# EAGLE schematic euxoloti core rev2 (EAGLE 6.1)

## Sheet 1 of 3
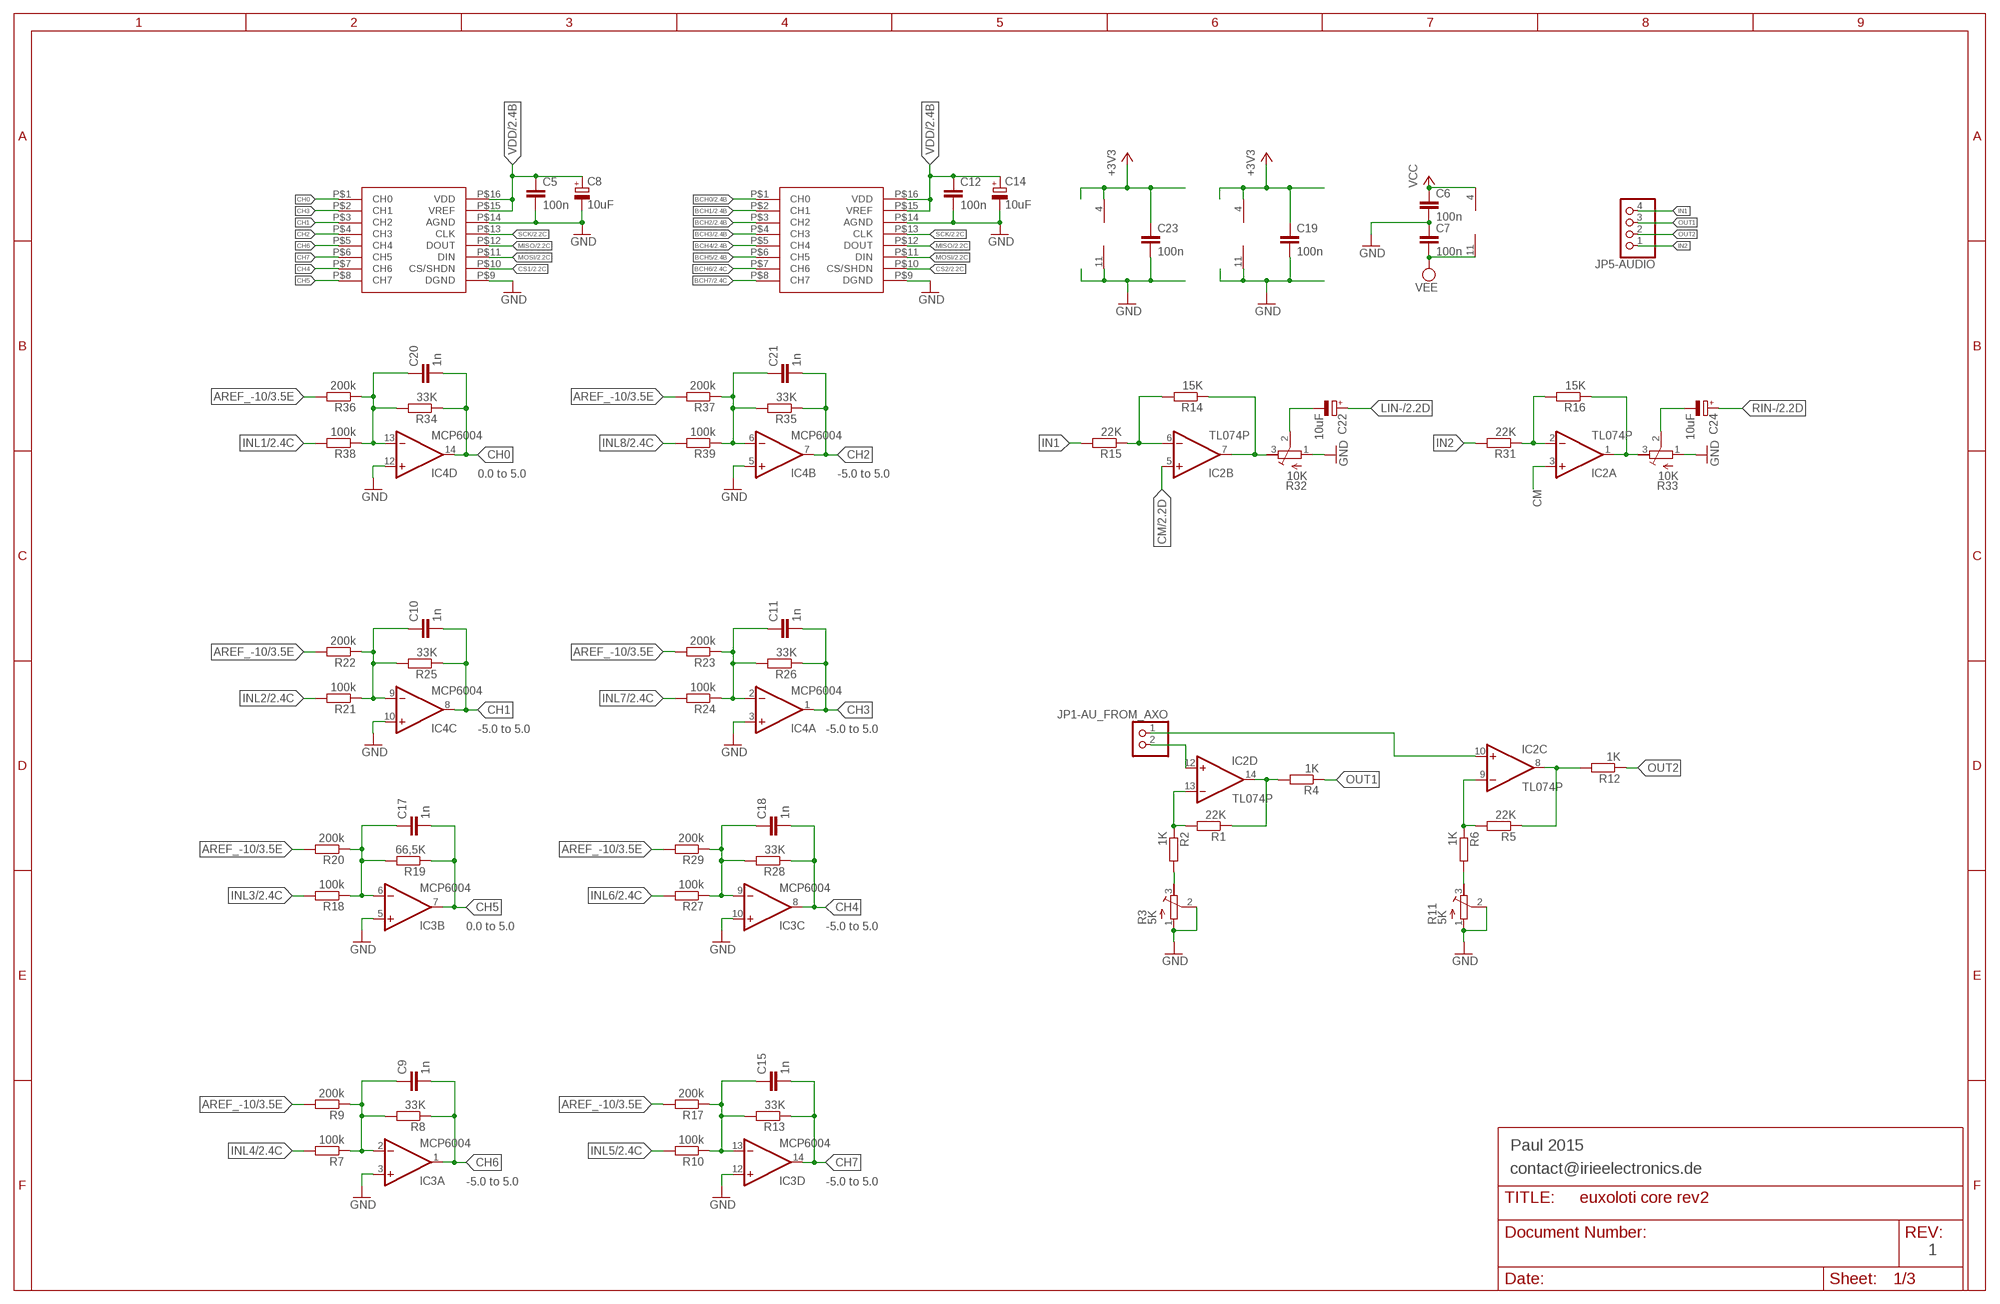
[diagram p0: schematic, sheet 1]

### Parts
C5  100n  C-EU025-025X050  [C025-025X050]
C6  100n  C-EU025-025X050  [C025-025X050]
C7  100n  C-EU025-025X050  [C025-025X050]
C8  10uF  CPOL-EUE1.8-4  [E1,8-4]
C9  1n  C-EU050-025X075  [C050-025X075]
C10  1n  C-EU050-025X075  [C050-025X075]
C11  1n  C-EU050-025X075  [C050-025X075]
C12  100n  C-EU025-025X050  [C025-025X050]
C14  10uF  CPOL-EUE1.8-4  [E1,8-4]
C15  1n  C-EU050-025X075  [C050-025X075]
C17  1n  C-EU050-025X075  [C050-025X075]
C18  1n  C-EU050-025X075  [C050-025X075]
C19  100n  C-EU025-025X050  [C025-025X050]
C20  1n  C-EU050-025X075  [C050-025X075]
C21  1n  C-EU050-025X075  [C050-025X075]
C22  10uF  CPOL-EUE1.8-4  [E1,8-4]
C23  100n  C-EU025-025X050  [C025-025X050]
C24  10uF  CPOL-EUE1.8-4  [E1,8-4]
IC2  TL074P  [DIL14]
IC3  MCP6004  TL074P  [DIL14]
IC4  MCP6004  TL074P  [DIL14]
JP1-AU_FROM_AXO  PINHD-1X2/90  [1X02/90]
JP5-AUDIO  PINHD-1X4_2.54  [1X04]
R1  22K  R-EU_0207/10  [0207/10]
R2  1K  R-EU_0207/12  [0207/12]
R3  5K  R-TRIMM3296P  [RTRIM3296P]
R4  1K  R-EU_0207/7  [0207/7]
R5  22K  R-EU_0207/7  [0207/7]
R6  1K  R-EU_0207/7  [0207/7]
R7  100k  R-EU_0207/7  [0207/7]
R8  33K  R-EU_0207/7  [0207/7]
R9  200k  R-EU_0207/10  [0207/10]
R10  100k  R-EU_0207/7  [0207/7]
R11  5K  R-TRIMM3296P  [RTRIM3296P]
R12  1K  R-EU_0207/10  [0207/10]
R13  33K  R-EU_0207/7  [0207/7]
R14  15K  R-EU_0207/7  [0207/7]
R15  22K  R-EU_0207/7  [0207/7]
R16  15K  R-EU_0207/7  [0207/7]
R17  200k  R-EU_0207/7  [0207/7]
R18  100k  R-EU_0207/7  [0207/7]
R19  66,5K  R-EU_0207/7  [0207/7]
R20  200k  R-EU_0207/10  [0207/10]
R21  100k  R-EU_0207/7  [0207/7]
R22  200k  R-EU_0207/7  [0207/7]
R23  200k  R-EU_0207/7  [0207/7]
R24  100k  R-EU_0207/10  [0207/10]
R25  33K  R-EU_0207/7  [0207/7]
R26  33K  R-EU_0207/7  [0207/7]
R27  100k  R-EU_0207/7  [0207/7]
R28  33K  R-EU_0207/7  [0207/7]
R29  200k  R-EU_0207/7  [0207/7]
R31  22K  R-EU_0207/7  [0207/7]
R32  10K  R-TRIMM3296P  [RTRIM3296P]
R33  10K  R-TRIMM3296P  [RTRIM3296P]
R34  33K  R-EU_0207/7  [0207/7]
R35  33K  R-EU_0207/7  [0207/7]
R36  200k  R-EU_0207/7  [0207/7]
R37  200k  R-EU_0207/7  [0207/7]
R38  100k  R-EU_0207/7  [0207/7]
R39  100k  R-EU_0207/7  [0207/7]
U$4  MCP3208_DIP  [MCP2308]
U$5  MCP3208_DIP  [MCP2308]

### Nets
+3V3: C19.1 C23.1 IC3.4(P:V+) IC4.4(P:V+) ; also sheet 2
AREF_-10: R9.2 R17.2 R20.2 R22.2 R23.2 R29.2 R36.2 R37.2 ; also sheet 3
BCH0: U$5.P$1(CH0) ; also sheet 2
BCH1: U$5.P$2(CH1) ; also sheet 2
BCH2: U$5.P$3(CH2) ; also sheet 2
BCH3: U$5.P$4(CH3) ; also sheet 2
BCH4: U$5.P$5(CH4) ; also sheet 2
BCH5: U$5.P$6(CH5) ; also sheet 2
BCH6: U$5.P$7(CH6) ; also sheet 2
BCH7: U$5.P$8(CH7) ; also sheet 2
CH0: C20.2 IC4.14(D:OUT) R34.1 U$4.P$1(CH0)
CH1: C10.2 IC4.8(C:OUT) R25.1 U$4.P$3(CH2)
CH2: C21.2 IC4.7(B:OUT) R35.1 U$4.P$4(CH3)
CH3: C11.2 IC4.1(A:OUT) R26.1 U$4.P$2(CH1)
CH4: C18.2 IC3.8(C:OUT) R28.1 U$4.P$7(CH6)
CH5: C17.2 IC3.7(B:OUT) R19.1 U$4.P$8(CH7)
CH6: C9.2 IC3.1(A:OUT) R8.1 U$4.P$5(CH4)
CH7: C15.2 IC3.14(D:OUT) R13.1 U$4.P$6(CH5)
CM: IC2.3(A:+IN) IC2.5(B:+IN) ; also sheet 2
CS1: U$4.P$10(CS/SHDN) ; also sheet 2
CS2: U$5.P$10(CS/SHDN) ; also sheet 2
GND: C5.2 C6.2 C7.1 C8.- C12.2 C14.- C19.2 C23.2 IC3.3(A:+IN) IC3.5(B:+IN) IC3.10(C:+IN) IC3.11(P:V-) IC3.12(D:+IN) IC4.3(A:+IN) IC4.5(B:+IN) IC4.10(C:+IN) IC4.11(P:V-) IC4.12(D:+IN) R3.1(E) R3.2(S) R11.1(E) R11.2(S) R32.1(E) R33.1(E) U$4.P$9(DGND) U$4.P$14(AGND) U$5.P$9(DGND) U$5.P$14(AGND) ; also sheet 2,3
IN1: JP5-AUDIO.4 R15.2
IN2: JP5-AUDIO.1 R31.2
INL1: R38.2 ; also sheet 2
INL2: R21.2 ; also sheet 2
INL3: R18.2 ; also sheet 2
INL4: R7.2 ; also sheet 2
INL5: R10.2 ; also sheet 2
INL6: R27.2 ; also sheet 2
INL7: R24.2 ; also sheet 2
INL8: R39.2 ; also sheet 2
LIN-: C22.+ ; also sheet 2
MISO: U$4.P$12(DOUT) U$5.P$12(DOUT) ; also sheet 2
MOSI: U$4.P$11(DIN) U$5.P$11(DIN) ; also sheet 2
N$2: C10.1 IC4.9(C:-IN) R21.1 R22.1 R25.2
N$4: R2.2 R3.3(A)
N$5: C11.1 IC4.2(A:-IN) R23.1 R24.1 R26.2
N$6: IC2.13(D:-IN) R1.2 R2.1
N$7: IC2.14(D:OUT) R1.1 R4.2
N$8: C22.- R32.2(S)
N$9: R6.2 R11.3(A)
N$10: IC2.9(C:-IN) R5.2 R6.1
N$11: C20.1 IC4.13(D:-IN) R34.2 R36.1 R38.1
N$12: IC2.8(C:OUT) R5.1 R12.2
N$13: IC2.10(C:+IN) JP1-AU_FROM_AXO.1
N$14: IC2.12(D:+IN) JP1-AU_FROM_AXO.2
N$15: C21.1 IC4.6(B:-IN) R35.2 R37.1 R39.1
N$16: C24.- R33.2(S)
N$17: IC2.6(B:-IN) R14.2 R15.1
N$18: C9.1 IC3.2(A:-IN) R7.1 R8.2 R9.1
N$19: IC2.7(B:OUT) R14.1 R32.3(A)
N$20: C15.1 IC3.13(D:-IN) R10.1 R13.2 R17.1
N$21: IC2.2(A:-IN) R16.2 R31.1
N$22: C17.1 IC3.6(B:-IN) R18.1 R19.2 R20.1
N$23: IC2.1(A:OUT) R16.1 R33.3(A)
N$24: C18.1 IC3.9(C:-IN) R27.1 R28.2 R29.1
OUT1: JP5-AUDIO.3 R4.1
OUT2: JP5-AUDIO.2 R12.1
RIN-: C24.+ ; also sheet 2
SCK: U$4.P$13(CLK) U$5.P$13(CLK) ; also sheet 2
VCC: C6.1 IC2.4(P:V+) ; also sheet 3
VDD: C5.1 C8.+ C12.1 C14.+ U$4.P$15(VREF) U$4.P$16(VDD) U$5.P$15(VREF) U$5.P$16(VDD) ; also sheet 2
VEE: C7.2 IC2.11(P:V-) ; also sheet 3

### Notes on the sheet
- 0.0 to 5.0 | -5.0 to 5.0
- -5.0 to 5.0 | -5.0 to 5.0
- 0.0 to 5.0 | -5.0 to 5.0
- Paul 2015
- contact@irieelectronics.de
- -5.0 to 5.0 | -5.0 to 5.0
- 1

## Sheet 2 of 3
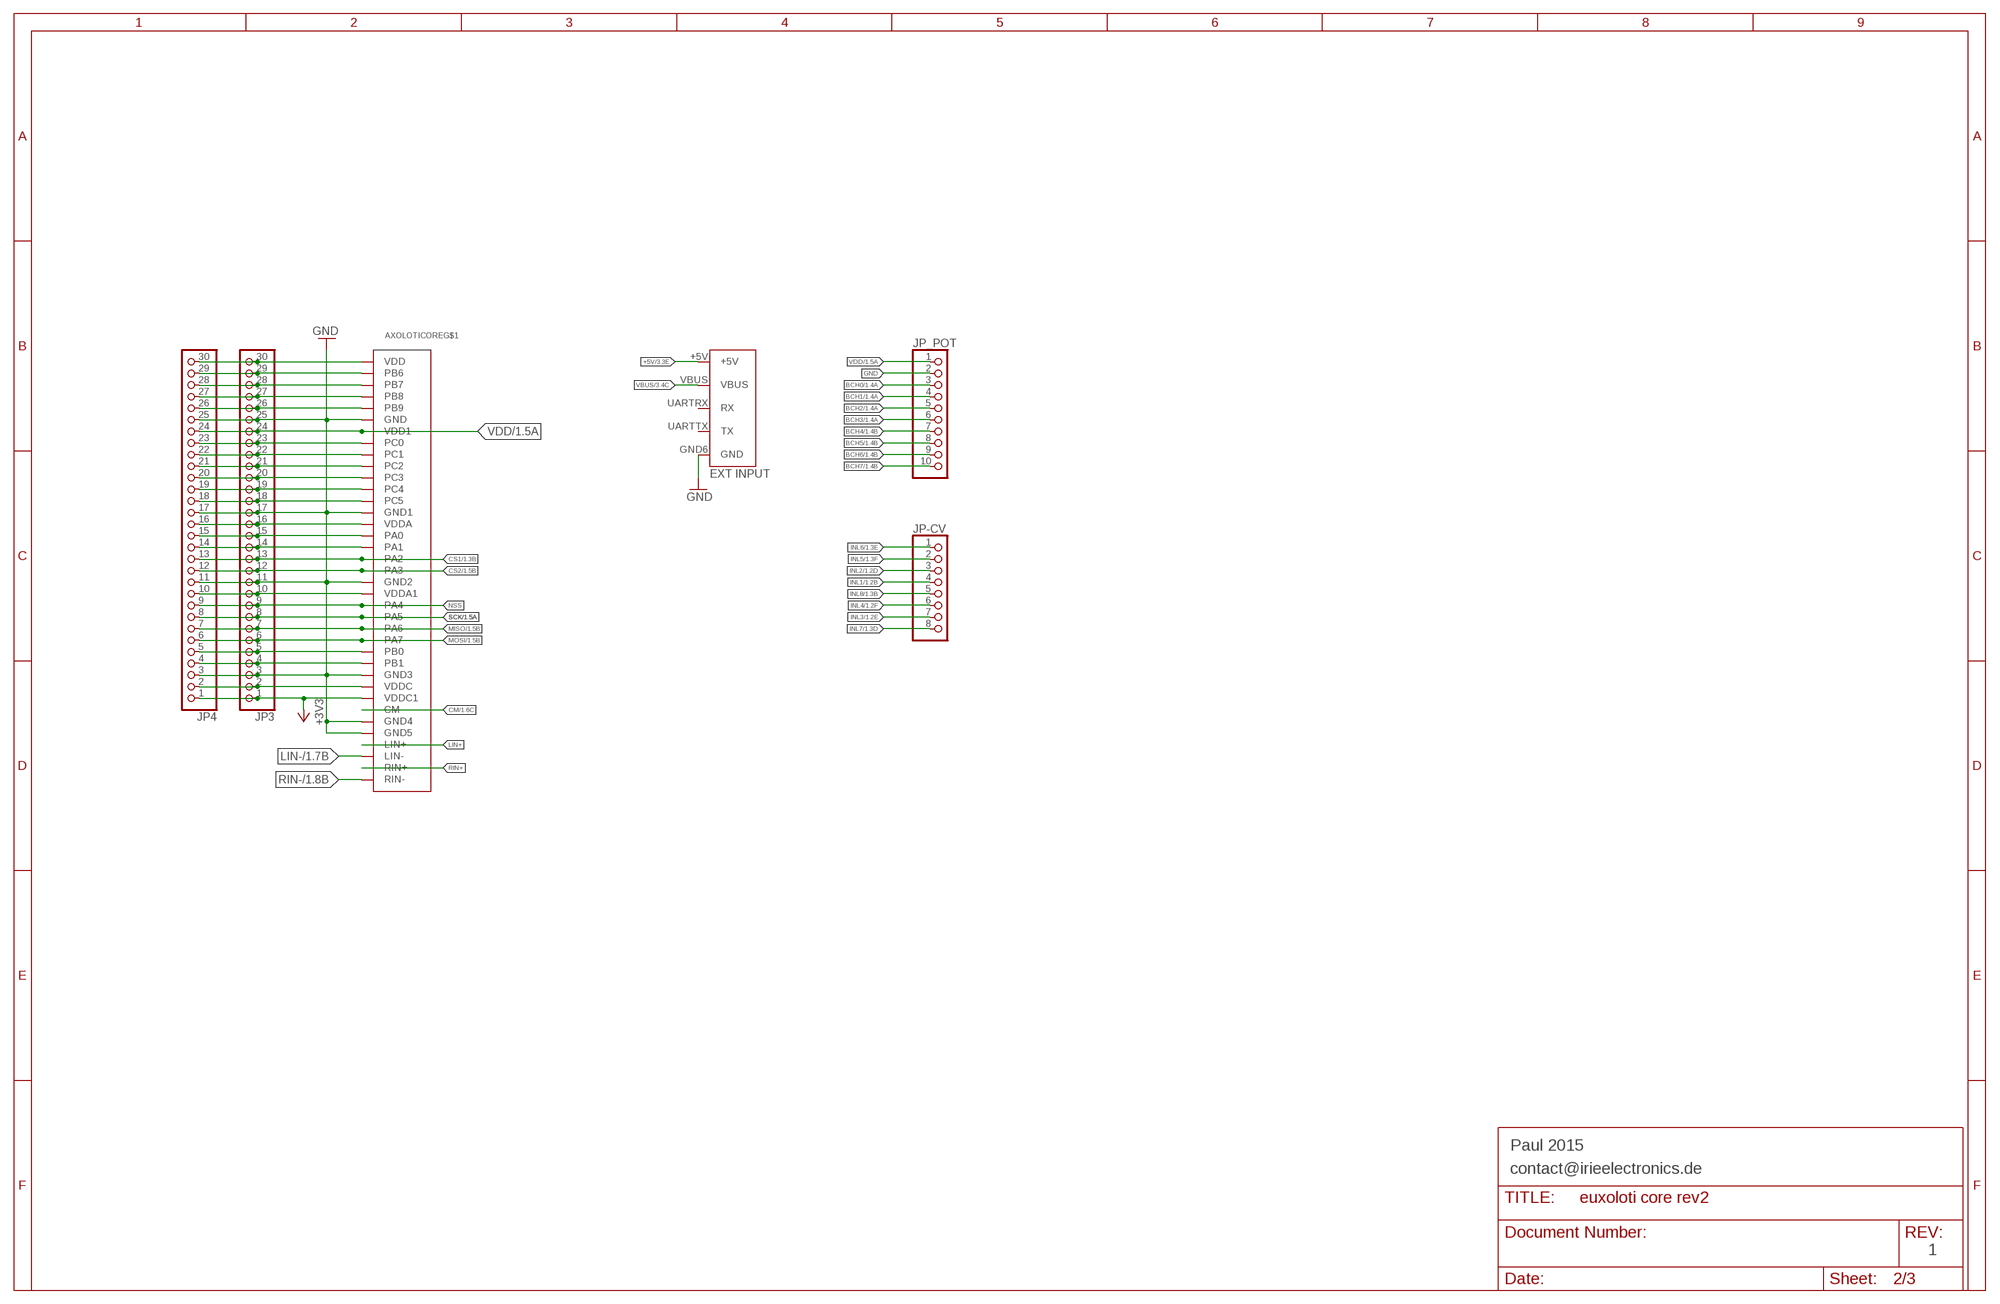
[diagram p1: schematic, sheet 2]

### Parts
AXOLOTICORE  AXOLOTI-CORE  [AXOLOTI-CORE]
JP3  PINHD-1X30  [1X30]
JP4  PINHD-1X30  [1X30]
JP-CV  PINHD-1X8_2.54  [1X08]
JP_POT  PINHD-1X10  [1X10]

### Nets
+3V3: AXOLOTICORE.VDDC1 JP3.1 JP4.1 ; also sheet 1
+5V: AXOLOTICORE.+5V ; also sheet 3
BCH0: JP_POT.3 ; also sheet 1
BCH1: JP_POT.4 ; also sheet 1
BCH2: JP_POT.5 ; also sheet 1
BCH3: JP_POT.6 ; also sheet 1
BCH4: JP_POT.7 ; also sheet 1
BCH5: JP_POT.8 ; also sheet 1
BCH6: JP_POT.9 ; also sheet 1
BCH7: JP_POT.10 ; also sheet 1
CM: AXOLOTICORE.CM ; also sheet 1
CS1: AXOLOTICORE.PA2 JP3.13 JP4.13 ; also sheet 1
CS2: AXOLOTICORE.PA3 JP3.12 JP4.12 ; also sheet 1
GND: AXOLOTICORE.GND AXOLOTICORE.GND1 AXOLOTICORE.GND2(GND3) AXOLOTICORE.GND3(GND2) AXOLOTICORE.GND4 AXOLOTICORE.GND5 AXOLOTICORE.GND6(GND) JP3.3 JP3.11 JP3.17 JP3.25 JP4.3 JP4.11 JP4.17 JP4.25 JP_POT.2 ; also sheet 1,3
INL1: JP-CV.4 ; also sheet 1
INL2: JP-CV.3 ; also sheet 1
INL3: JP-CV.7 ; also sheet 1
INL4: JP-CV.6 ; also sheet 1
INL5: JP-CV.2 ; also sheet 1
INL6: JP-CV.1 ; also sheet 1
INL7: JP-CV.8 ; also sheet 1
INL8: JP-CV.5 ; also sheet 1
LIN+: AXOLOTICORE.LIN+
LIN-: AXOLOTICORE.LIN- ; also sheet 1
MISO: AXOLOTICORE.PA6 JP3.7 JP4.7 ; also sheet 1
MOSI: AXOLOTICORE.PA7 JP3.6 JP4.6 ; also sheet 1
N$26: AXOLOTICORE.PB1 JP3.4 JP4.4
N$27: AXOLOTICORE.PB0 JP3.5 JP4.5
N$29: AXOLOTICORE.VDDC JP3.2 JP4.2
N$32: AXOLOTICORE.VDDA1 JP3.10 JP4.10
N$36: AXOLOTICORE.PA1 JP3.14 JP4.14
N$37: AXOLOTICORE.PA0 JP3.15 JP4.15
N$38: AXOLOTICORE.VDDA JP3.16 JP4.16
N$40: AXOLOTICORE.PC5 JP3.18 JP4.18
N$41: AXOLOTICORE.PC4 JP3.19 JP4.19
N$42: AXOLOTICORE.PC3 JP3.20 JP4.20
N$43: AXOLOTICORE.PC2 JP3.21 JP4.21
N$44: AXOLOTICORE.PC1 JP3.22 JP4.22
N$45: AXOLOTICORE.PC0 JP3.23 JP4.23
N$48: AXOLOTICORE.PB9 JP3.26 JP4.26
N$49: AXOLOTICORE.PB8 JP3.27 JP4.27
N$50: AXOLOTICORE.PB7 JP3.28 JP4.28
N$51: AXOLOTICORE.PB6 JP3.29 JP4.29
NSS: AXOLOTICORE.PA4 JP3.9 JP4.9
RIN+: AXOLOTICORE.RIN+
RIN-: AXOLOTICORE.RIN- ; also sheet 1
SCK: AXOLOTICORE.PA5 JP3.8 JP4.8 ; also sheet 1
VBUS: AXOLOTICORE.VBUS ; also sheet 3
VDD: AXOLOTICORE.VDD1 JP3.24 JP4.24 JP_POT.1 ; also sheet 1
VDD+: AXOLOTICORE.VDD JP3.30 JP4.30
Unconnected: AXOLOTICORE.UARTRX(RX) AXOLOTICORE.UARTTX(TX)

### Notes on the sheet
- Paul 2015
- contact@irieelectronics.de
- 1

## Sheet 3 of 3
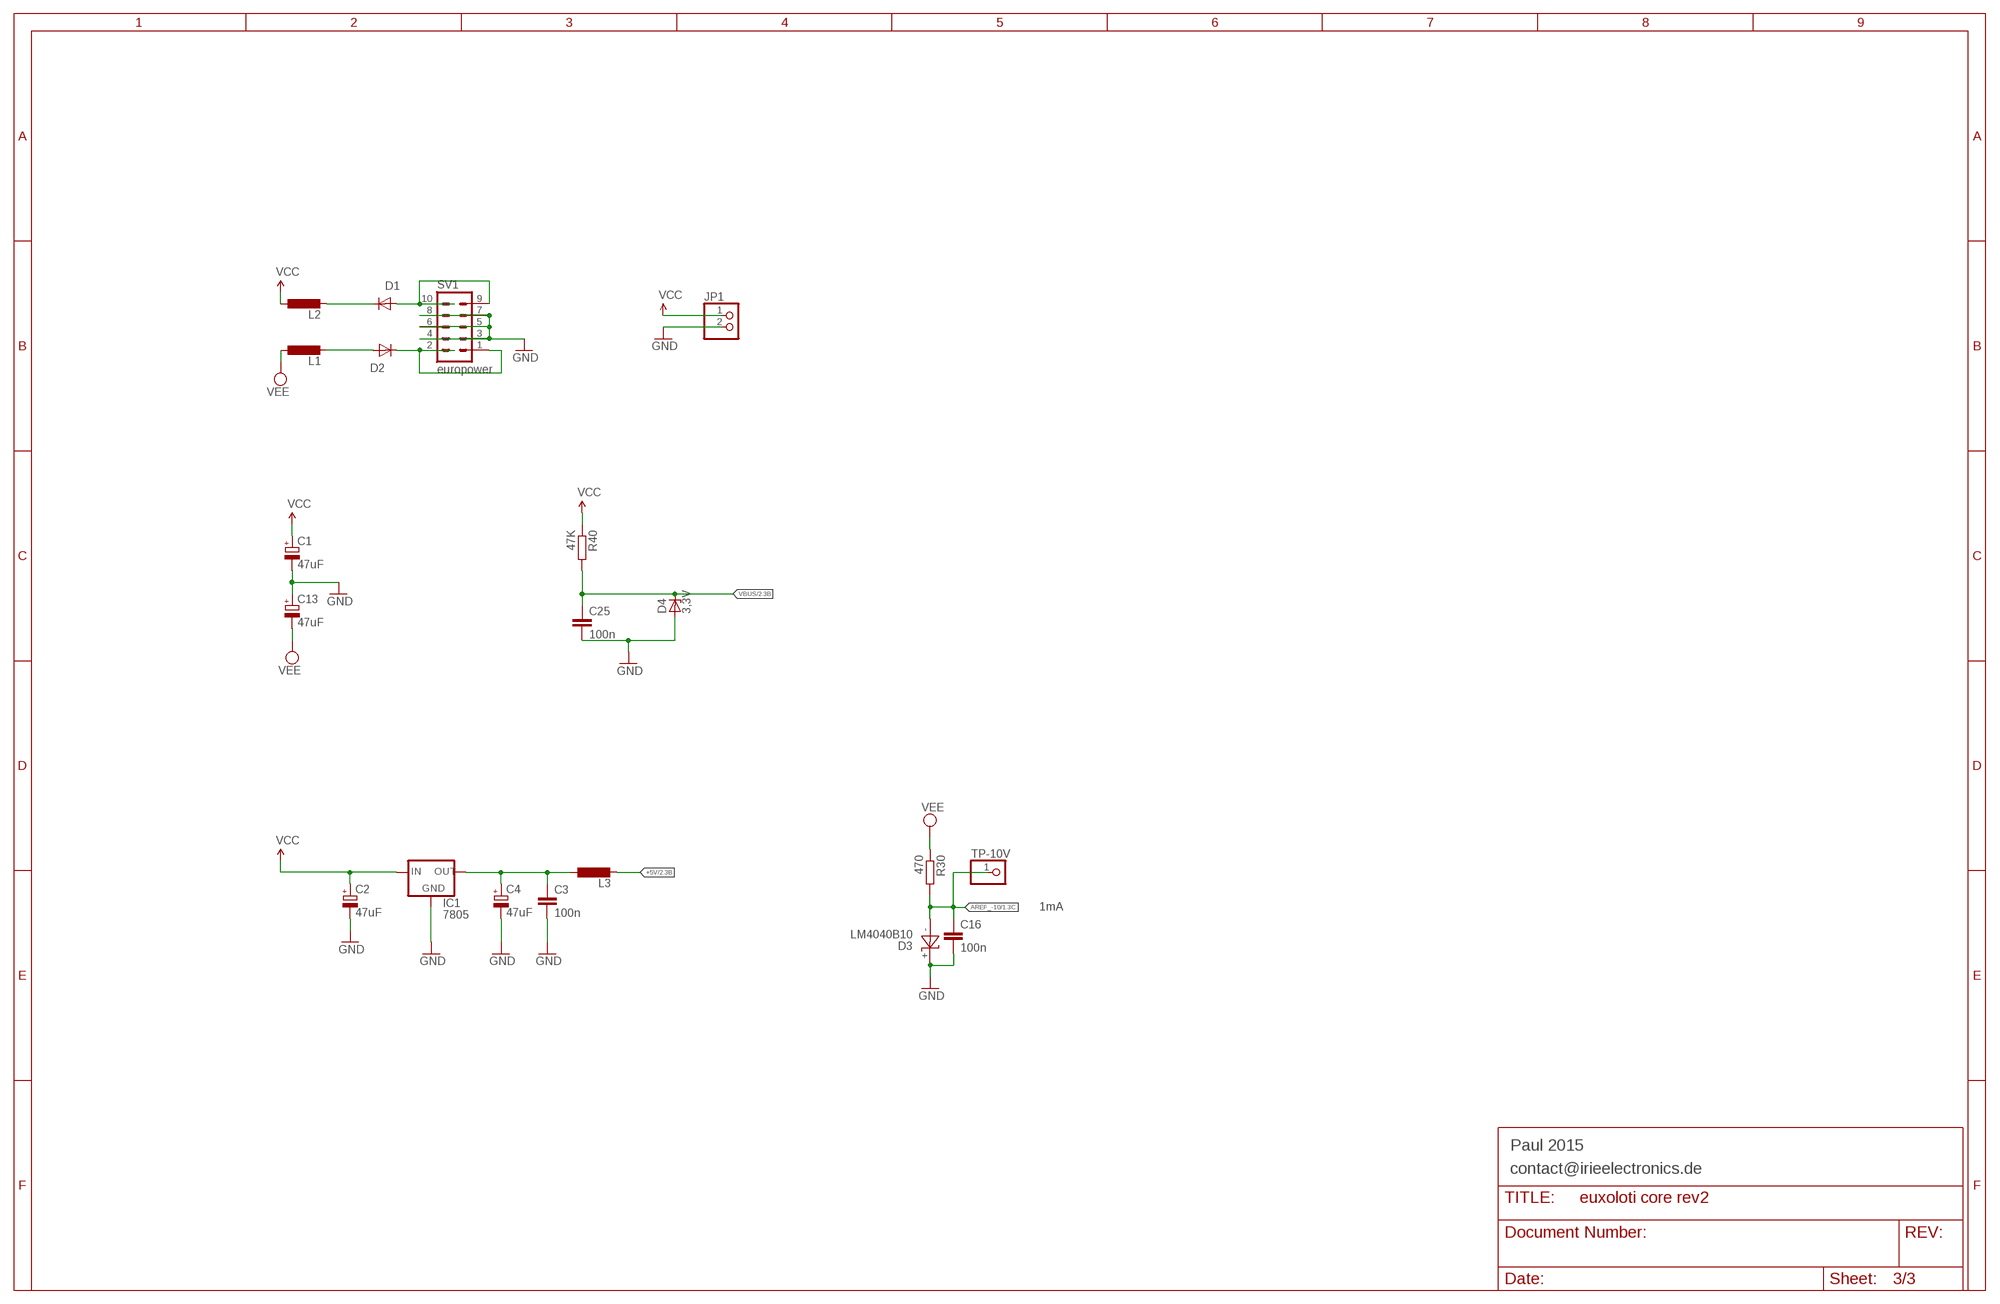
[diagram p2: schematic, sheet 3]

### Parts
C1  47uF  CPOL-EUE2-5  [E2-5]
C2  47uF  CPOL-EUE2-5  [E2-5]
C3  100n  C-EU025-025X050  [C025-025X050]
C4  47uF  CPOL-EUE2.5-5  [E2,5-5]
C13  47uF  CPOL-EUE2-5  [E2-5]
C16  100n  C-EU025-025X050  [C025-025X050]
C25  100n  C-EU025-025X050  [C025-025X050]
D1  1N5819HW  1N4148DO35-10  [DO35-10]
D2  1N5819HW  1N4148DO35-10  [DO35-10]
D3  LM4040B10  LM4040DIP  [TO-92]
D4  3,3V  1N821  [DO35Z10]
IC1  7805  78XXS  [78XXS]
JP1  PINHD-1X2  [1X02]
L1  L-EU0207/10  [0207/10]
L2  L-EU0207/10  [0207/10]
L3  L-EU0207/10  [0207/10]
R30  470  R-EU_0207/12  [0207/12]
R40  47K  R-EU_0207/7  [0207/7]
SV1  europower  EURO_POWER_HEADERFAT_PADS  [EURO_PWR_HEADER_FAT]
TP-10V  PINHD-1X1_2.54  [1X01]

### Nets
+5V: L3.2 ; also sheet 2
+5V_RAW: C3.1 C4.+ IC1.OUT L3.1
AREF_-10: C16.1 D3.- R30.2 TP-10V.1 ; also sheet 1
GND: C1.- C2.- C3.2 C4.- C13.+ C16.2 C25.2 D3.+ D4.A IC1.GND JP1.2 SV1.3 SV1.4 SV1.5 SV1.6 SV1.7 SV1.8 ; also sheet 1,2
N$1: D1.C L2.2
N$3: D2.A L1.2
N$56: D1.A SV1.9 SV1.10
N$64: D2.C SV1.1 SV1.2
VBUS: C25.1 D4.C R40.2 ; also sheet 2
VCC: C1.+ C2.+ IC1.IN JP1.1 L2.1 R40.1 ; also sheet 1
VEE: C13.- L1.1 R30.1 ; also sheet 1

### Notes on the sheet
- 1mA
- Paul 2015
- contact@irieelectronics.de

## Library data of the parts
AXOLOTICORE = axoloti core:AXOLOTI-CORE
C1 C2 C4 C8 C13 C14 C22 C24 = resistor-mod:CPOL-EU: POLARIZED CAPACITOR, European symbol
C3 C5-C7 C9-C12 C15-C21 C23 C25 = resistor-mod:C-EU: CAPACITOR, European symbol
D1 D2 = diode:1N4148: DIODE high speed (Philips)
D3 = GuShH:LM4040
D4 = diode:1N821: Reference DIODE temperature compensated, 6,2 V
IC1 = v-reg:78XXS: VOLTAGE REGULATOR
IC2-IC4 = linear:TL074: OP AMP
JP1 JP1-AU_FROM_AXO = pinhead:PINHD-1X2: PIN HEADER
JP3 JP4 = pinhead:PINHD-1X30: PIN HEADER
JP5-AUDIO = pinhead 2:PINHD-1X4: PIN HEADER
JP-CV = pinhead 2:PINHD-1X8: PIN HEADER
JP_POT = pinhead:PINHD-1X10: PIN HEADER
L1-L3 = resistor-mod:L-EU: INDUCTOR, European symbol
R1 R2 R4-R10 R12-R31 R34-R40 = resistor-mod:R-EU_: RESISTOR, European symbol
R3 R11 R32 R33 = resistor-mod:R-TRIMM: Trimm resistor
SV1 = MusicThingModular:EURO_POWER_HEADER: Power Header 10 pin power header for Eurorack Power Supplies Variants with fatter pads for easier soldering, and the LOCK variant which has 5mil offset pins to hold the component in place before soldering
TP-10V = pinhead 2:PINHD-1X1: PIN HEADER
U$4 U$5 = mcp2308:MCP3208_DIP: MCP3208 DIP